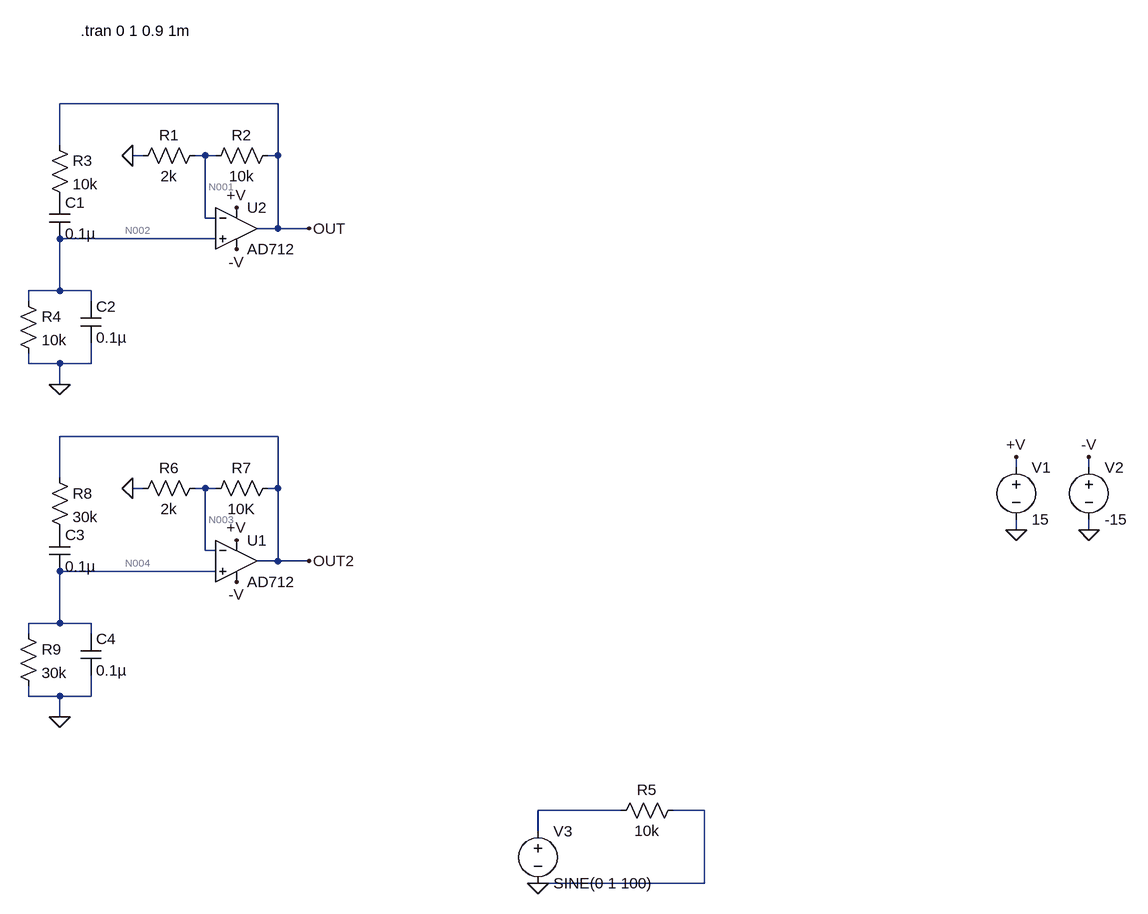
[diagram p0: schematic RCSineWaveOscillator.asc]
* RCSineWaveOscillator.asc
V1 +V 0 15
R1 N001 0 2k
R2 OUT N001 10k
V2 -V 0 -15
* U2: AD712 (symbol AD712 not available, pins judged from their places): In+=N002 In-=N001 V+=+V V-=-V OUT=OUT
R3 OUT P001 10k
C1 P001 N002 0.1µ
R4 N002 0 10k
C2 N002 0 0.1µ
V3 N005 0 SINE(0 1 100)
R5 0 N005 10k
R6 N003 0 2k
R7 OUT2 N003 10K
* U1: AD712 (symbol AD712 not available, pins judged from their places): In+=N004 In-=N003 V+=+V V-=-V OUT=OUT2
R8 OUT2 P002 30k
C3 P002 N004 0.1µ
R9 N004 0 30k
C4 N004 0 0.1µ
.tran 0 1 0.9 1m
.backanno
.end

* Results of the author's LTspice run, read from the files saved beside the schematic
* Operating Point, zero values left out:
*   V(n002) = -250 nV
*   V(-v) = -15 V
*   V(n004) = -250 nV
*   V(n003) = -750 nV
*   V(+v) = 15 V
*   V(out) = -1.25 µV
*   V(p001) = -1.25 µV
*   V(n001) = -750 nV
*   V(out2) = -4.25 µV
*   V(p002) = -4.25 µV
*   I(V1) = -9.797 mA
*   I(R2) = -100 pA
*   I(R4) = -25 pA
*   I(R7) = -350 pA
*   I(R6) = -375 pA
*   I(R9) = -25 pA
*   I(R1) = -125 pA
*   I(V2) = 9.797 mA
*   Ix(u1:1) = 25 pA
*   Ix(u1:2) = 25 pA
*   Ix(u1:3) = 4.899 mA
*   Ix(u1:4) = -4.899 mA
*   Ix(u1:5) = 350 pA
*   Ix(u2:1) = 25 pA
*   Ix(u2:2) = 25 pA
*   Ix(u2:3) = 4.899 mA
*   Ix(u2:4) = -4.899 mA
*   Ix(u2:5) = 100 pA
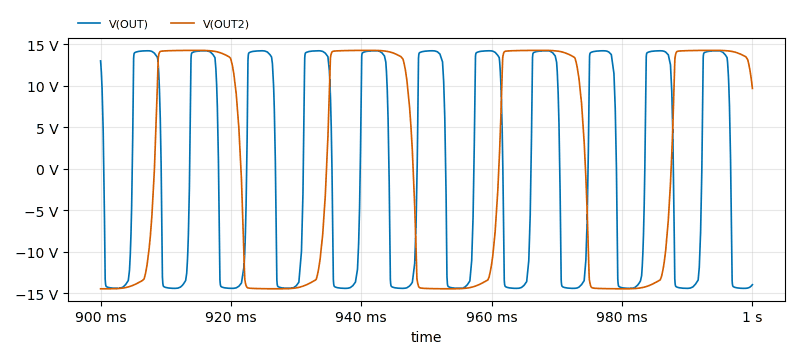
[diagram p1: Transient Analysis of RCSineWaveOscillator.asc, plotted from the saved traces]
* Transient Analysis, 1 run:
*   V(OUT): min -14.43 V, max 14.18 V, average -394.2 mV, rms 13.41 V, last -13.99 V
*   V(OUT2): min -14.48 V, max 14.23 V, average 603.1 mV, rms 13.51 V, last 9.65 V